# EAGLE design tractor_v2 (EAGLE 7.7.0)
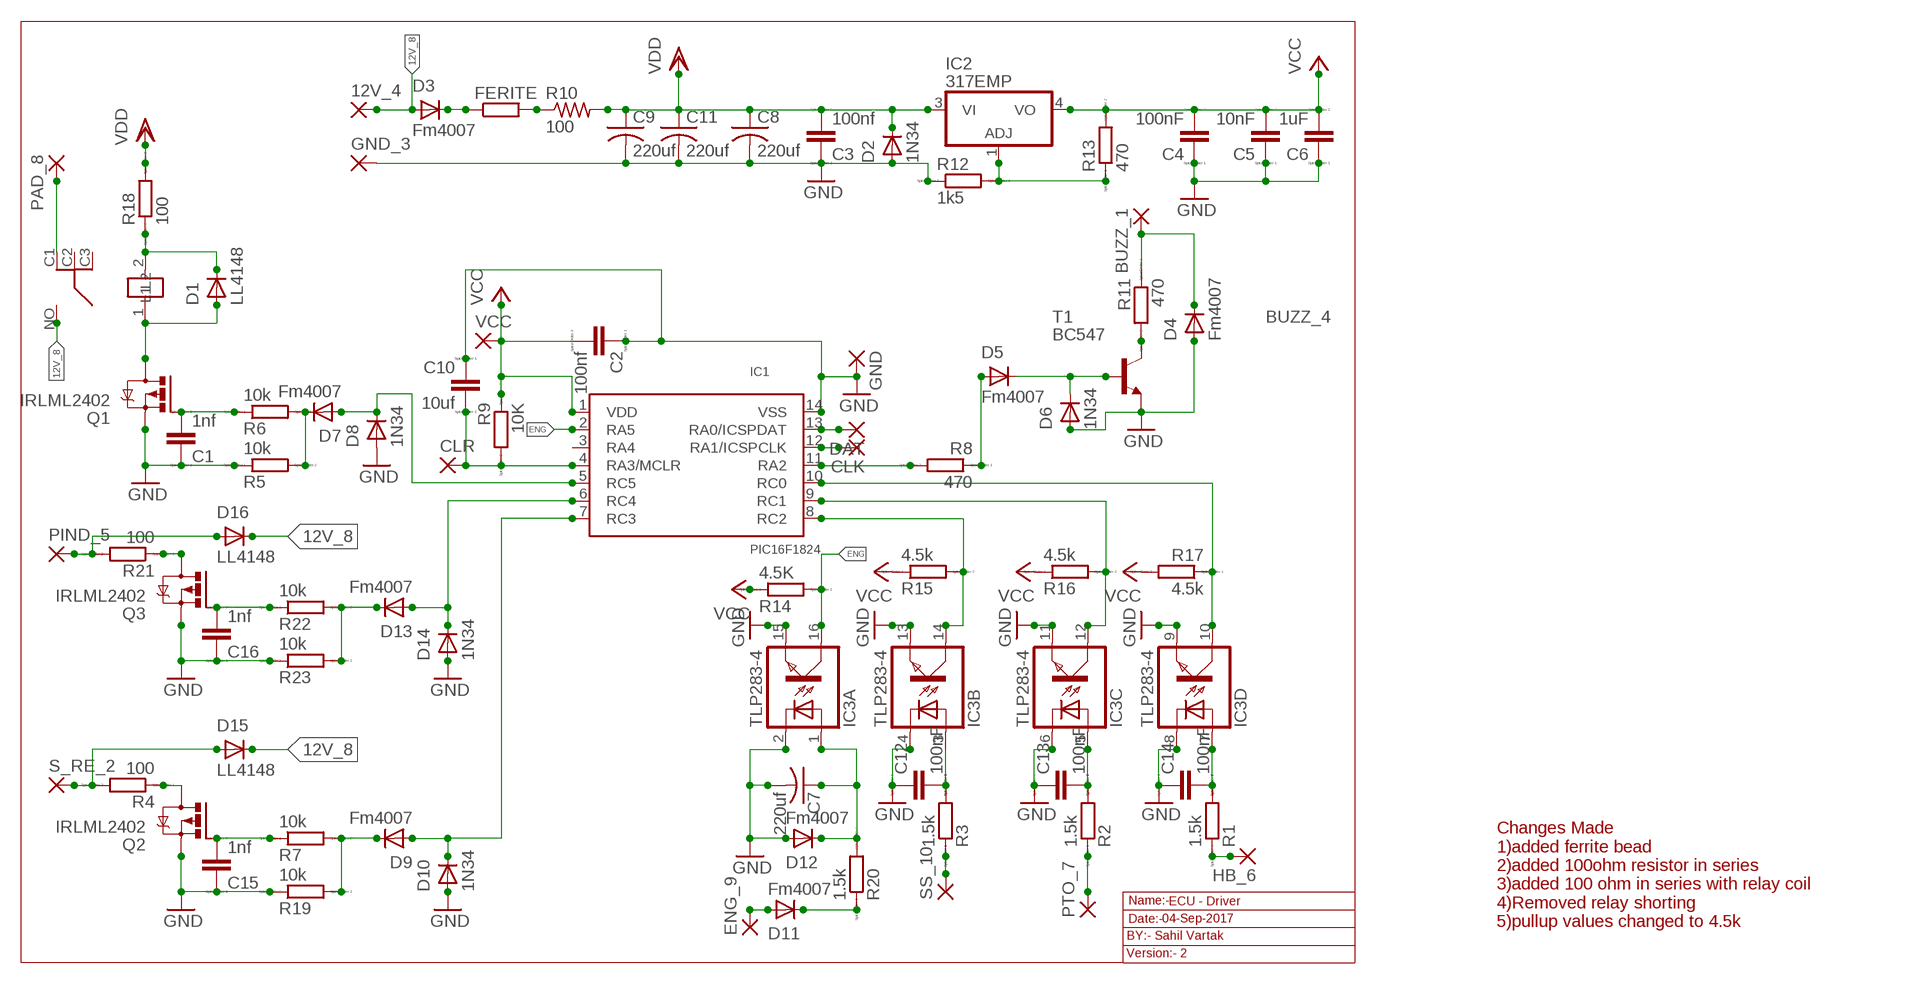
[diagram p0: schematic, sheet 1]

## Parts
12V_4  2,54/1,1  [2,54/1,1]
BUZZ_1  2,54/1,1  [2,54/1,1]
C1  1nf  CC0603  [C0603]
C2  100nf  CC0603  [C0603]
C3  100nf  CC0603  [C0603]
C4  100nF  CC0603  [C0603]
C5  10nF  CC0603  [C0603]
C6  1uF  CC0603  [C0603]
C7  220uf  C-US025-025X050  [C025-025X050]
C8  220uf  C-US025-025X050  [C025-025X050]
C9  220uf  C-US025-025X050  [C025-025X050]
C10  10uf  CC0603  [C0603]
C11  220uf  C-US025-025X050  [C025-025X050]
C12  100nF  CC0603  [C0603]
C13  100nF  CC0603  [C0603]
C14  100nF  CC0603  [C0603]
C15  1nf  CC0603  [C0603]
C16  1nf  CC0603  [C0603]
CLK  1,6/0,8  [1,6/0,8]
CLR  1,6/0,8  [1,6/0,8]
D1  LL4148  GF1  [SMA-DO214AC]
D2  1N34  GF1  [SMA-DO214AC]
D3  Fm4007  GF1  [SMA-DO214AC]
D4  Fm4007  GF1  [SMA-DO214AC]
D5  Fm4007  GF1  [SMA-DO214AC]
D6  1N34  GF1  [SMA-DO214AC]
D7  Fm4007  GF1  [SMA-DO214AC]
D8  1N34  GF1  [SMA-DO214AC]
D9  Fm4007  GF1  [SMA-DO214AC]
D10  1N34  GF1  [SMA-DO214AC]
D11  Fm4007  GF1  [SMA-DO214AC]
D12  Fm4007  GF1  [SMA-DO214AC]
D13  Fm4007  GF1  [SMA-DO214AC]
D14  1N34  GF1  [SMA-DO214AC]
D15  LL4148  GF1  [SMA-DO214AC]
D16  LL4148  GF1  [SMA-DO214AC]
DAT  1,6/0,8  [1,6/0,8]
ENG_9  2,54/1,1  [2,54/1,1]
FERITE  R-EU_R0603  [R0603]
GND  1,6/0,8  [1,6/0,8]
GND_3  2,54/1,1  [2,54/1,1]
HB_6  2,54/1,1  [2,54/1,1]
IC1  PIC16F1824  [SO-14]
IC2  317EMP  [SOT223]
IC3  TLP283-4  [MINI-FLAT-16]
K2  RL703  [RL703]
PAD_8  2,54/1,1  [2,54/1,1]
PIND_5  2,54/1,1  [2,54/1,1]
PTO_7  2,54/1,1  [2,54/1,1]
Q1  IRLML2402  IRLML5203  [MICRO3]
Q2  IRLML2402  IRLML5203  [MICRO3]
Q3  IRLML2402  IRLML5203  [MICRO3]
R1  1.5k  RR0603  [R0603]
R2  1.5k  RR0603  [R0603]
R3  1.5k  RR0603  [R0603]
R4  100  RR0603  [R0603]
R5  10k  RR0603  [R0603]
R6  10k  RR0603  [R0603]
R7  10k  RR0603  [R0603]
R8  470  RR0603  [R0603]
R9  10K  RR0603  [R0603]
R10  100  R-US_WSC2515  [WSC2515]
R11  470  RR0603  [R0603]
R12  1k5  RR0603  [R0603]
R13  470  RR0603  [R0603]
R14  4.5K  RR0603  [R0603]
R15  4.5k  RR0603  [R0603]
R16  4.5k  RR0603  [R0603]
R17  4.5k  RR0603  [R0603]
R18  100  RR0603  [R0603]
R19  10k  RR0603  [R0603]
R20  1.5k  RR0603  [R0603]
R21  100  RR0603  [R0603]
R22  10k  RR0603  [R0603]
R23  10k  RR0603  [R0603]
S_RE_2  2,54/1,1  [2,54/1,1]
SS_10  2,54/1,1  [2,54/1,1]
T1  BC547  [TO92]
VCC  1,6/0,8  [1,6/0,8]

## Nets
12V_8: 12V_4.1(P) D3.A D15.K(C) D16.K(C) K2.NO
BUZZ_4: BUZZ_1.1(P) D4.K(C) R11.1
ENG: IC1.2(RA5) IC3.16(A:COL) R14.2
GND: C1.1 C2.1 C3.1 C4.1 C5.1 C6.1 C7.2 C8.2 C9.2 C10.1 C11.2 C12.1 C13.1 C14.1 C15.1 C16.1 D2.A D4.A D6.A D8.A D10.A D12.A D14.A GND.1(P) GND_3.1(P) IC1.14(VSS) IC3.2(A:C) IC3.4(B:C) IC3.6(C:C) IC3.8(D:C) IC3.9(D:EMIT) IC3.11(C:EMIT) IC3.13(B:EMIT) IC3.15(A:EMIT) Q1.2(S) Q2.2(S) Q3.2(S) R5.1 R12.1 R19.1 R23.1 T1.1(E)
N$1: D11.K(C) R20.1
N$3: IC1.10(RC0) IC3.10(D:COL) R17.1
N$5: D1.A K2.1(L2) Q1.3(D)
N$6: C16.2 Q3.1(G) R22.1
N$7: D3.K(C) FERITE.1
N$8: DAT.1(P) IC1.13(RA0/ICSPDAT)
N$9: CLK.1(P) IC1.12(RA1/ICSPCLK)
N$13: D1.K(C) K2.2(L1) R18.1
N$14: IC2.1(ADJ) R12.2 R13.1
N$15: FERITE.2 R10.1
N$16: D5.A R8.1
N$17: D7.A D8.K(C) IC1.5(RC5)
N$18: C15.2 Q2.1(G) R7.1
N$19: D9.K(C) R7.2 R19.2
N$21: Q2.3(D) R4.1
N$22: D11.A ENG_9.1(P)
N$23: C7.1 D12.K(C) IC3.1(A:A) R20.2
N$24: D13.K(C) R22.2 R23.2
N$25: D16.A PIND_5.1(P) R21.2
N$26: D13.A D14.K(C) IC1.6(RC4)
N$27: D15.A R4.2 S_RE_2.1(P)
N$28: Q3.3(D) R21.1
N$29: HB_6.1(P) R1.1
N$30: R3.1 SS_10.1(P)
N$31: PTO_7.1(P) R2.1
N$32: D9.A D10.K(C) IC1.7(RC3)
N$72: C1.2 Q1.1(G) R6.1
N$74: D7.K(C) R5.2 R6.2
N$78: C12.2 IC3.3(B:A) R3.2
N$80: C13.2 IC3.5(C:A) R2.2
N$82: C14.2 IC3.7(D:A) R1.2
N$84: IC1.9(RC1) IC3.12(C:COL) R16.2
N$85: IC1.8(RC2) IC3.14(B:COL) R15.2
N$87: C10.2 CLR.1(P) IC1.4(RA3/MCLR) R9.2
N$88: IC1.11(RA2) R8.2
N$89: D5.K(C) D6.K(C) T1.2(B)
N$90: R11.2 T1.3(C)
R_3: K2.C1 PAD_8.1(P)
VCC: C2.2 C4.2 C5.2 C6.2 IC1.1(VDD) IC2.4(VO) R9.1 R13.2 R14.1 R15.1 R16.1 R17.2 VCC.1(P)
VDD: C3.2 C8.1 C9.1 C11.1 D2.K(C) IC2.3(VI) R10.2 R18.2
Unconnected: IC1.3(RA4) K2.C2 K2.C3

## Notes on the sheet
- Name:- | ECU - Driver
- Date:- | 04-Sep-2017
- Changes Made
  1)added ferrite bead
  2)added 100ohm resistor in series
  3)added 100 ohm in series with relay coil
  4)Removed relay shorting
  5)pullup values changed to 4.5k
- BY:- Sahil Vartak
- Version:- 2

## Library data of the parts
12V_4 BUZZ_1 ENG_9 GND_3 HB_6 PAD_8 PIND_5 PTO_7 S_RE_2 SS_10 = wirepad:2,54/1,1: THROUGH-HOLE PAD
C1-C6 C10 C12-C16 = eagle-ltspice:C: CAPACITOR, European symbol; SPICEMODEL: NONE; SPICEPREFIX: C
C7-C9 C11 = rcl:C-US: CAPACITOR, American symbol
CLK CLR DAT GND VCC = wirepad:1,6/0,8: THROUGH-HOLE PAD
D1-D16 = diode:GF1: DIODE
FERITE = resistor:R-EU_: RESISTOR, European symbol
IC1 = microchip:PIC16F1824
IC2 = lm317:*317: Positive VOLTAGE REGULATOR
IC3 = optocoupler:TLP283-4: TOSHIBA PHOTOCOUPLER GaAs IRED & PHOTO-TRANSISTOR Source: http://www.semicon.toshiba.co.jp/td/en/Opto/Photocoupler/en_20050928_TLP283_datasheet.pdf; OC_FARNELL: unknown; OC_NEWARK: unknown
K2 = relay:RL703
Q1-Q3 = transistor-power:IRLML5203: HEXFET P-Channel Power MOSFET
R1-R9 R11-R23 = eagle-ltspice:R: RESISTOR, European symbol; SPICEMODEL: NONE; SPICEPREFIX: R
R10 = resistor:R-US_: RESISTOR, American symbol
T1 = transistor-neu-to92:BC547: NPN TRANSISTOR

## Board
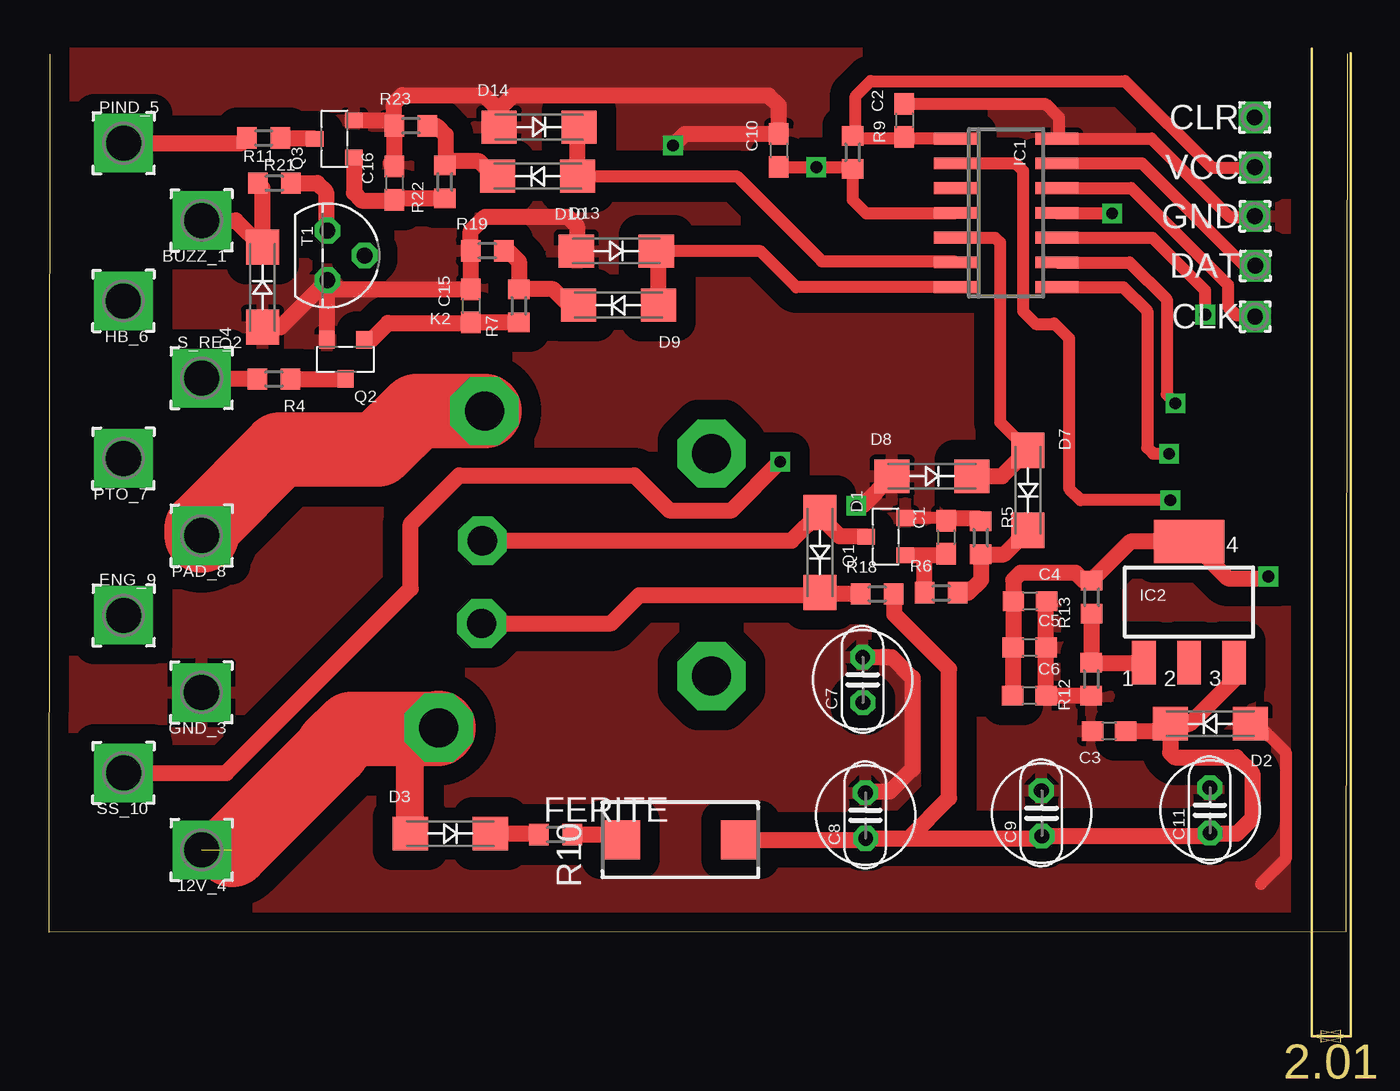
[diagram p1: board, top side]
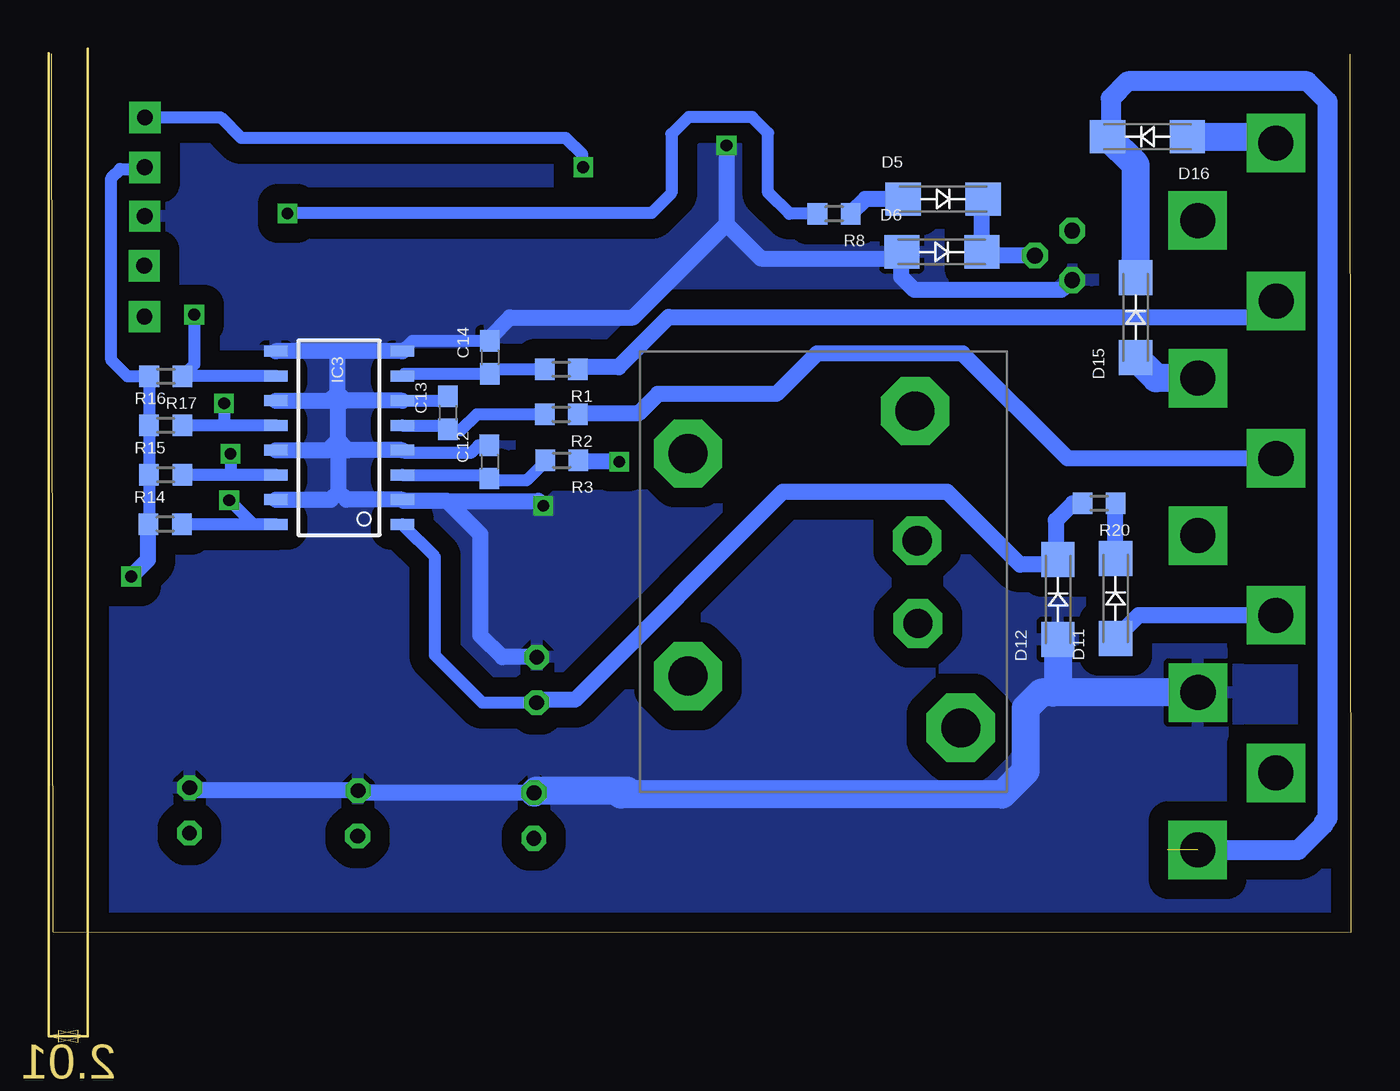
[diagram p2: board, bottom side, seen from below]

Size 66.62 x 45.05 mm. Coordinates in mm from the lower left corner, seen from the top.
Outline: 0.04,45.01 0,0 66.53,0.01
Outline: 66.53,0.01 66.62,45.05
Copper layers (1*16): Top 0.035mm / dielectric 1.5mm / Bottom 0.035mm
Design rules "default": minimum track width 10mil, minimum drill 24mil, track to track 8mil, track to pad 8mil, pad to pad 8mil, via to via 8mil, smd to smd 8mil, copper to edge 40mil, drill to drill 8mil, minimum pad ring 10mil, minimum via ring 8mil, stop-mask expansion 4mil, vias tented up to drill 0mil, thermal gap 10mil

### Footprints (pad centres in the part's own frame; a part is rotated, then mirrored left to right if it is on the bottom)
2,54/1,1 = drill 1.8 pad 3 square: 1 0,0
C0603 = smd 1.1 x 1: 1 -0.85,0; 2 0.85,0
C025-025X050 = drill 0.762 pad 1.27 octagon: 1 -1.176,-0.006; 2 1.159,0.007
1,6/0,8 = drill 0.813 pad 1.6 square: 1 0,0
SMA-DO214AC = smd 1.8 x 1.7: A -2.05,0; K 2.05,0
R0603 = smd 1 x 1.1: 1 -0.85,0; 2 0.85,0
SO-14 = smd 0.6 x 2.2: 1 -3.81,-2.6; 2 -2.54,-2.6; 3 -1.27,-2.6; 4 0,-2.6; 5 1.27,-2.6; 6 2.54,-2.6; 7 3.81,-2.6; 8 3.81,2.6; 9 2.54,2.6; 10 1.27,2.6; 11 0,2.6; 12 -1.27,2.6; 13 -2.54,2.6; 14 -3.81,2.6
SOT223 = smd 1.219 x 2.235: 1 -2.311,-3.099; 2 0,-3.099; 3 2.311,-3.099 | smd 3.6 x 2.2: 4 0,3.099
MINI-FLAT-16 = smd 1.2 x 0.56: 1 -3.24,4.445; 2 -3.24,3.175; 3 -3.24,1.905; 4 -3.24,0.635; 5 -3.24,-0.635; 6 -3.24,-1.905; 7 -3.24,-3.175; 8 -3.24,-4.445; 9 3.24,-4.445; 10 3.24,-3.175; 11 3.24,-1.905; 12 3.24,-0.635; 13 3.24,0.635; 14 3.24,1.905; 15 3.24,3.175; 16 3.24,4.445
RL703 = drill 1.5 pad 2.5 octagon: 1 1.73,-5.643; 2 -2.51,-5.693 | drill 2 pad 3.5 octagon: C1 8.38,-5.543; C2 6.2,6.107; C3 -5.21,6.107; NO -7.86,-7.883
MICRO3 = smd 0.8 x 0.9: 1 -0.95,-1; 2 0.95,-1; 3 0,1
WSC2515 = smd 2 x 2: 1 -3.075,0; 2 3.075,0
TO92 = drill 0.813 octagon: 1 1.27,0; 2 0,1.905; 3 -1.27,0

### Placement (x,y rotation side)
12V_4  7.84,4.22 180 top
BUZZ_1  7.84,36.49 180 top
C1  46.01,20.24 270 top
C2  43.87,41.62 270 top
C3  54.37,10.31 0 top
C4  50.31,16.98 180 top
C5  50.29,14.6 180 top
C6  50.28,12.12 180 top
C7  41.74,12.94 90 top
C8  41.88,5.99 90 top
C9  50.91,6.1 90 top
C10  37.43,40.08 270 top
C11  59.54,6.25 90 top
C12  44.16,24.11 270 bottom
C13  46.3,26.63 270 bottom
C14  44.14,29.47 270 bottom
C15  21.65,32.11 270 top
C16  17.72,38.41 270 top
CLK  61.85,31.57 90 top
CLR  61.83,41.78 90 top
D1  39.54,19.47 270 top
D2  59.56,10.69 180 top
D3  20.59,5.05 0 top
D4  10.96,33.07 90 top
D5  20.9,37.59 0 bottom
D6  20.97,34.88 0 bottom
D7  50.21,22.66 270 top
D8  45.29,23.38 0 top
D9  29.21,32.15 180 top
D10  29.1,34.93 0 top
D11  12.06,17.11 90 bottom
D12  15.01,17.06 90 bottom
D13  25.07,38.76 180 top
D14  25.14,41.28 0 top
D15  11.03,31.52 90 bottom
D16  10.42,40.79 180 bottom
DAT  61.87,34.17 90 top
ENG_9  3.84,16.24 0 top
FERITE  25.99,5.01 0 top
GND  61.84,36.71 90 top
GND_3  7.83,12.29 180 top
HB_6  3.83,32.37 180 top
IC1  49.08,36.88 270 top
IC2  58.47,16.92 0 top
IC3  51.87,25.35 180 bottom
K2  27.88,18.34 90 bottom
PAD_8  7.84,20.33 180 top
PIND_5  3.84,40.46 0 top
PTO_7  3.83,24.29 180 top
Q1  42.92,20.28 90 top
Q2  15.22,29.37 180 top
Q3  14.65,40.68 90 top
R1  40.48,28.86 180 bottom
R2  40.49,26.55 180 bottom
R3  40.46,24.19 180 bottom
R4  11.55,28.36 180 top
R5  47.78,20.22 270 top
R6  45.76,17.39 0 top
R7  24.11,32.11 90 top
R8  26.49,36.84 180 bottom
R9  41.22,39.99 270 top
R10  32.4,4.73 0 top
R11  11.56,38.41 0 top
R12  53.45,12.96 90 top
R13  53.46,17.17 90 top
R14  60.79,20.93 0 bottom
R15  60.77,23.45 0 bottom
R16  60.76,25.99 0 bottom
R17  60.76,28.5 180 bottom
R18  42.48,17.34 0 top
R19  22.49,34.94 0 top
R20  12.91,21.99 180 bottom
R21  11.02,40.72 180 top
R22  20.3,38.47 90 top
R23  18.56,41.35 0 top
S_RE_2  7.84,28.41 0 top
SS_10  3.84,8.16 180 top
T1  14.29,34.7 270 top
VCC  61.84,39.22 90 top

### Tracks (layer width: path | path; a pad name or v marks a point on that pad's centre or on a via)
12V_8  (1 unrouted)
  Top 1.422: D3.A 18.54,9.02 K2.NO
  Top 3.81: 9.4,4.22 14.56,9.38 14.56,9.47 15.52,10.43 19.95,10.43 K2.NO
  Bottom 1.016: 12V_4.1 2.69,4.22 1.4,5.51 1.4,5.62 1.18,5.84 1.18,42.59 2.22,43.63 11.43,43.63 12.31,42.75 12.31,40.95 D16.K
  Bottom 1.422: 12.41,40.85 D16.K 11.03,39.35 D15.K
BUZZ_4
  Top 0.813: R11.1 10.96,38.16 D4.K 9.59,36.49 BUZZ_1.1
ENG  (via drill 0.6)
  Top 0.61: v57.51,22.15 52.92,22.15 52.31,22.76 52.31,30.46 51.56,31.21 51.54,31.19 50.61,31.19 49.95,31.85 49.95,39.04 49.57,39.42 IC1.2
  Bottom 0.61: 56.26,20.9 59.92,20.9 R14.2 | IC3.16 56.26,20.9 | 56.26,20.9 v57.51,22.15
GND  (via drill 0.6)
  Top 0.61: C2.1 51.1,42.47 51.8,41.77 51.8,40.81 IC1.14 56.55,40.69 60.57,36.67 61.8,36.67 GND.1 | 45.86,21.23 Q1.2 | D2.A 61.97,10.69 63.42,9.24 63.42,3.74 62.15,2.47
  Top 0.813: R12.1 51.14,12.11 C6.1 C5.1 51.14,16.96 C4.1 | C1.1 45.86,21.23 47.62,21.23 R5.1 | 17.54,39.44 C16.1 R23.1 | R23.1 17.71,42.5 18.13,42.92 22.31,42.92 23.06,42.17 | 23.06,42.17 23.06,41.55 D14.A | 27.08,34.96 27.08,36.21 26.6,36.69 22.38,36.69 21.64,35.95 R19.1 C15.1 14.76,32.96 T1.1 | Q3.2 17.43,41.63 R23.1 | D4.A 11.88,31.02 T1.1 | Q2.2 14.27,33.41 T1.1 | 23.06,42.17 23.79,42.9 36.91,42.9 37.43,42.38 C10.1 32.6,40.93 v32.01,40.34 | v41.4,21.86 41.72,21.86 D8.A | C7.2 43.23,14.1 44.29,13.04 44.29,8.37 43.12,7.2 41.92,7.2 C8.2
  Bottom 0.61: C12.1 44.73,24.96 45.11,24.58 48.5,24.58 IC3.4 | IC3.6 46.53,27.25 C13.1 | C14.1 48.11,30.32 IC3.8 | 44.73,7.21 44.67,7.15
  Bottom 0.813: C8.2 44.67,7.15 50.79,7.15 C9.2 59.38,7.26 C11.2 | IC3.8 51.78,29.79 | 51.78,29.79 IC3.9 | IC3.6 51.55,27.25 51.92,27.62 | 51.95,27.65 51.95,29.62 51.78,29.79 | IC3.4 51.42,24.71 51.75,25.04 | 51.75,25.04 51.75,25.06 51.92,25.23 | 51.92,25.23 51.92,27.62 | 51.92,27.62 51.95,27.65 | 51.9,22.58 51.49,22.17 IC3.2 48.58,22.12 46.34,22.12 | 51.9,22.58 51.9,24.89 51.75,25.04 | IC3.15 52.31,22.17 51.9,22.58 | IC3.13 52.44,24.71 51.92,25.23 | IC3.11 52.35,27.25 51.95,27.65 | D12.A | v32.01,40.34 32.01,36.3 | 32.01,36.3 30.25,34.54 23.36,34.54 D6.A 23.04,34.86 23.04,33.6 22.37,32.93 14.84,32.93 14.34,33.43 T1.1 14.17,33.31 | C14.1 44.14,30.5 43.12,31.52 36.79,31.52 32.01,36.3 | C7.2 43.5,14.1 44.62,15.22 44.62,20.4 46.34,22.12 | 46.34,22.12 41.66,22.12 v41.4,21.86
  Bottom 1.422: 37.1,7.25 37.63,7.25 | 37.63,7.25 41.77,7.25 C8.2 | GND_3.1 15.25,12.29 | 15.25,12.29 15.87,12.29 16.68,11.48 16.68,8.25 17.87,7.06 37.44,7.06 37.63,7.25 | D12.A 15.02,12.52 15.25,12.29
  pour Bottom (isolate 1.016): 0.03,45.06 66.34,45.06 66.34,-0.11 0.03,-0.11
  pour Top (isolate 1.016): -0.03,45.06 66.76,45.06 66.76,0.25 -0.03,0.25
N$1
  Bottom 0.813: D11.K R20.1
N$3  (via drill 0.6)
  Top 0.61: IC1.10 56.6,35.61 59.29,32.92 v59.29,31.68 v59.3,31.67
  Bottom 0.61: IC3.10 59.89,28.52 R17.1 59.3,29.11 v59.3,31.67
N$5
  Top 0.813: Q1.3 41.89,20.31 40.55,20.31 39.54,21.32 D1.A 38.09,20.07 K2.1
N$6
  Top 0.813: R22.1 17.78,37.62 C16.2 17.68,37.52 16.04,37.52 15.65,37.91 Q3.1
N$7
  Top 0.813: D3.K 25.1,5.05 FERITE.1
N$8
  Top 0.61: IC1.13 56.06,39.42 61.33,34.15 61.85,34.15 DAT.1
N$9
  Top 0.61: IC1.12 55.51,38.15 60.46,33.2 60.46,32.08 60.91,31.63 61.79,31.63 CLK.1
N$13
  Top 0.813: R18.1 39.63,17.34 D1.K 39.4,17.28 30.29,17.28 28.84,15.83 K2.2
N$14
  Top 0.813: R13.1 53.46,13.82 R12.2 56.14,13.81 IC2.1
N$15
  Top 0.813: FERITE.2 29.05,5.01 R10.1
N$16
  Bottom 0.813: D5.A 24.89,37.59 R8.1
N$17
  Top 0.61: IC1.5 48.52,35.61 48.77,35.36 48.77,26.15 D7.A
  Top 0.813: D8.K 48.88,23.38 D7.A
N$18
  Top 0.813: R7.1 C15.2 21.63,31.24 17.4,31.24 16.53,30.37 Q2.1
N$19
  Top 0.813: R19.2 23.56,34.94 24.11,34.39 R7.2 25.86,32.97 26.68,32.15 D9.K
N$21
  Top 0.813: R4.1 Q2.3
N$22
  Bottom 0.813: ENG_9.1 10.88,16.24 D11.A
N$23
  Bottom 0.61: C7.1 44.52,11.76 46.96,14.2 46.96,19.23 IC3.1
  Bottom 0.813: R20.2 14.25,21.99 15.12,21.12 15.12,19.22 D12.K 15.01,18.84 16.96,18.84 20.69,22.57 29.13,22.57 39.78,11.92 41.59,11.92 C7.1
N$24
  Top 0.813: R23.2 19.88,41.35 20.36,40.87 20.36,39.38 R22.2 20.51,39.53 22.07,39.53 22.84,38.76 D13.K
N$25
  Top 0.813: PIND_5.1 9.91,40.46 R21.2
  Bottom 1.422: D16.A 4.17,40.79 PIND_5.1
N$26
  Top 0.61: D13.A 35.28,38.76 39.64,34.4 46.43,34.4 IC1.6
  Top 0.813: D13.A 27.12,41.51 D14.K
N$27
  Top 0.813: R4.2 7.89,28.36 S_RE_2.1
  Bottom 1.422: S_RE_2.1 9.97,28.41 D15.A
N$28
  Top 0.813: Q3.3 11.91,40.68 R21.1
N$29
  Bottom 0.813: HB_6.1 4.65,31.54 34.97,31.54 37.54,28.97 39.52,28.97 R1.1
N$30  (via drill 0.6)
  Top 0.813: SS_10.1 9.1,8.16 18.56,17.62 18.56,20.93 21.05,23.42 30.03,23.42 31.82,21.63 35.01,21.63 v37.5,24.12
  Bottom 0.813: v37.5,24.12 39.53,24.12 R3.1
N$31
  Bottom 0.813: R2.1 39.59,26.6 36.53,26.6 35.53,27.6 29.45,27.6 27.37,29.68 19.9,29.68 14.51,24.29 PTO_7.1
N$32
  Top 0.61: IC1.7 38.34,33.07 36.5,34.91 31.17,34.91 D10.K
  Top 0.813: D9.A 31.26,34.82 D10.K
N$72
  Top 0.813: Q1.1 44.81,19.33 | 44.81,19.33 45.95,19.33 C1.2 | R6.1 44.91,19.24 44.81,19.33
N$74
  Top 0.813: R6.2 47.13,17.39 47.81,18.07 47.81,19.3 R5.2 48.97,19.38 D7.K
N$78
  Bottom 0.61: IC3.3 44.34,23.44 C12.2 44.06,23.16 42.27,23.16 41.48,23.95 41.48,24.19 R3.2
  Bottom 0.813: 44.07,23.17 C12.2
N$80
  Bottom 0.61: IC3.5 46.5,25.98 C13.2 46.26,25.74 45.62,25.74 44.81,26.55 R2.2
N$82
  Bottom 0.61: R1.2 43.9,28.86 C14.2 48.54,28.62 IC3.7
N$84  (via drill 0.6)
  Top 0.61: IC1.9 55.43,34.34 57.32,32.45 57.32,27.57 v57.77,27.12
  Bottom 0.61: IC3.12 57.84,25.98 | 57.84,25.98 R16.2 | v57.77,27.12 57.77,26.05 57.84,25.98
N$85  (via drill 0.6)
  Top 0.61: IC1.8 55.11,33.07 56.32,31.86 56.32,24.84 56.63,24.53 v57.44,24.53
  Bottom 0.61: IC3.14 57.51,23.44 | 57.51,23.44 59.91,23.44 R15.2 | v57.44,24.53 57.44,23.51 57.51,23.44
N$87  (via drill 0.6)
  Top 0.61: C10.2 v39.36,39.23 41.13,39.23 R9.2 41.22,37.55 41.91,36.86 46.46,36.86 IC1.4
  Bottom 0.61: v39.36,39.23 39.39,39.26 39.39,39.87 39.4,39.87 40.25,40.72 56.89,40.72 57.95,41.78 CLR.1
N$88  (via drill 0.6)
  Top 0.61: v54.53,36.85 51.72,36.85 IC1.11
  Bottom 0.61: v54.52,36.84 v54.53,36.85 54.5,36.88 35.85,36.88 34.83,37.9 34.83,40.92 33.95,41.8 30.69,41.8 29.87,40.98 29.87,37.92 28.79,36.84 R8.2
N$89
  Bottom 0.813: T1.2 18.74,34.7 D6.K 18.92,37.52 D5.K
N$90
  Top 0.813: R11.2 13.77,38.41 14.21,37.97 14.21,36.05 T1.3
R_3
  Top 3.81: PAD_8.1 7.84,20.73 11.85,24.74 16.86,24.74 18.85,26.73 22.33,26.73 K2.C1
VCC  (via drill 0.6)
  Top 0.61: IC1.1 43.95,40.69 C2.2 43.78,40.69 41.37,40.69 | 41.37,40.69 41.37,42.87 42.14,43.64 55.2,43.64 59.65,39.19 61.81,39.19 VCC.1 | 41.37,40.69 R9.1
  Top 0.813: C6.2 49.44,12.13 C5.2 49.46,14.62 C4.2 49.46,18.05 49.83,18.42 52.66,18.42 53.06,18.02 R13.2 55.46,20.02 IC2.4 58.58,20.02 60.46,18.14 62.43,18.14 v62.53,18.24
  Bottom 0.61: R17.2 R16.1 | R16.1 | R16.1 R15.1 61.62,20.95 R14.1 61.68,20.97 | 61.65,28.46 R17.2 | R17.2 62.72,28.5 63.55,29.33 63.55,38.68 63.1,39.13 61.93,39.13 VCC.1
  Bottom 0.813: 61.68,20.97 61.68,19.09 v62.53,18.24
VDD
  Top 0.813: R10.2 41.8,4.73 C8.1 | C8.1 50.81,4.81 C9.1 59.4,4.92 C11.1 59.57,5.05 60.92,5.05 61.71,5.84 61.71,8.16 60.9,8.97 57.73,8.97 57.51,9.19 D2.K | C8.1 44.09,4.81 46.16,6.88 46.16,13.49 43.36,16.29 43.36,17.31 R18.2 | C3.2 57.13,10.31 D2.K | D2.K 58.51,10.69 60.84,13.02 60.84,13.76 IC2.3